# Altium schematic sheet PIC.SchDoc
size A4; SheetNumber: 1
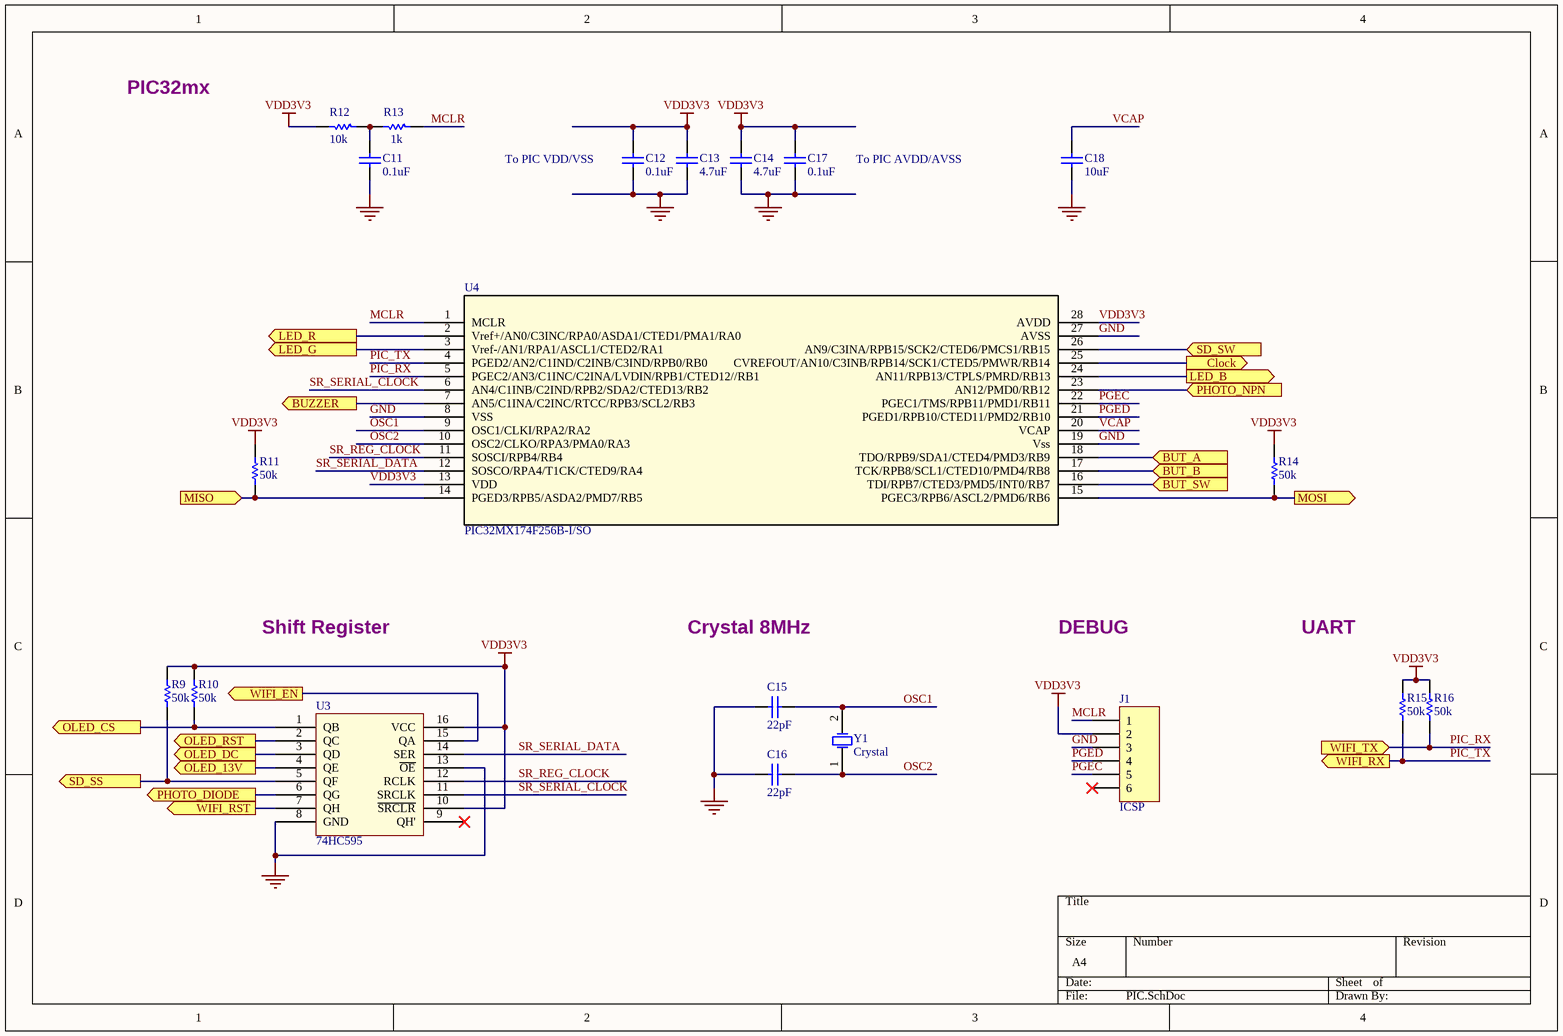
[diagram p0: PIC.SchDoc]

## Parts
C11  0.1uF  [CAPC1608X90N]
C12  0.1uF  [CAPC1608X90N]
C13  4.7uF  [CAPC1608X90N]
C14  4.7uF  [CAPC1608X90N]
C15  22pF  [CAPC1608X90N]
C16  22pF  [CAPC1608X90N]
C17  0.1uF  [CAPC1608X90N]
C18  10uF  [CAPC1608X90N]
J1  ICSP  [ICSP_HEADER]
R9  50k  [RESC1608X55N]
R10  50k  [RESC1608X55N]
R11  50k  [RESC1608X55N]
R12  10k  [RESC1608X55N]
R13  1k  [RESC1608X55N]
R14  50k  [RESC1608X55N]
R15  50k  [RESC1608X55N]
R16  50k  [RESC1608X55N]
U3  74HC595  [SOIC-16]
U4  PIC32MX174F256B-I/SO  [SOIC-28]
Y1  Crystal  [9C]

## Ports
BUT_A (in), BUT_B (in), BUT_SW (in), BUZZER (out), Clock (out), LED_B (out), LED_G (out), LED_R (out), MISO (in), MOSI (out), OLED_13V (out), OLED_CS (out), OLED_DC (out), OLED_RST (out), PHOTO_DIODE (out), PHOTO_NPN (in), SD_SS (out), SD_SW (in), WIFI_EN (out), WIFI_RST (out), WIFI_RX (out), WIFI_TX (in)

## Nets
GND: C11.1 C12.1 C13.1 C14.1 C15.2 C16.2 C17.1 C18.1 J1.3 U3.8(GND) U3.13(~{OE}) U4.8(VSS) U4.19(Vss) U4.27(AVSS)
VDD3V3: C12.2 C13.2 C14.2 C17.2 J1.2 R9.2 R10.2 R11.2 R12.2 R14.2 R15.2 R16.2 U3.10(~{SRCLR}) U3.16(VCC) U4.13(VDD) U4.28(AVDD)
BUT_A: U4.18(TDO/RPB9/SDA1/CTED4/PMD3/RB9) ; port BUT_A
BUT_B: U4.17(TCK/RPB8/SCL1/CTED10/PMD4/RB8) ; port BUT_B
BUT_SW: U4.16(TDI/RPB7/CTED3/PMD5/INT0/RB7) ; port BUT_SW
BUZZER: U4.7(AN5/C1INA/C2INC/RTCC/RPB3/SCL2/RB3) ; port BUZZER
Clock: U4.25(CVREFOUT/AN10/C3INB/RPB14/SCK1/CTED5/PMWR/RB14) ; port Clock
LED_B: U4.24(AN11/RPB13/CTPLS/PMRD/RB13) ; port LED_B
LED_G: U4.3(Vref-/AN1/RPA1/ASCL1/CTED2/RA1) ; port LED_G
LED_R: U4.2(Vref+/AN0/C3INC/RPA0/ASDA1/CTED1/PMA1/RA0) ; port LED_R
MCLR: J1.1 R13.1 U4.1(MCLR)
MISO: R11.1 U4.14(PGED3/RPB5/ASDA2/PMD7/RB5) ; port MISO
MOSI: R14.1 U4.15(PGEC3/RPB6/ASCL2/PMD6/RB6) ; port MOSI
OLED_13V: U3.4(QE) ; port OLED_13V
OLED_CS: R10.1 U3.1(QB) ; port OLED_CS
OLED_DC: U3.3(QD) ; port OLED_DC
OLED_RST: U3.2(QC) ; port OLED_RST
OSC1: C15.1 U4.9(OSC1/CLKI/RPA2/RA2) Y1.2
OSC2: C16.1 U4.10(OSC2/CLKO/RPA3/PMA0/RA3) Y1.1
PGEC: J1.5 U4.22(PGEC1/TMS/RPB11/PMD1/RB11)
PGED: J1.4 U4.21(PGED1/RPB10/CTED11/PMD2/RB10)
PHOTO_DIODE: U3.6(QG) ; port PHOTO_DIODE
PHOTO_NPN: U4.23(AN12/PMD0/RB12) ; port PHOTO_NPN
PIC_RX: R16.1 U4.5(PGEC2/AN3/C1INC/C2INA/LVDIN/RPB1/CTED12//RB1) ; port WIFI_TX
PIC_TX: R15.1 U4.4(PGED2/AN2/C1IND/C2INB/C3IND/RPB0/RB0) ; port WIFI_RX
SD_SS: R9.1 U3.5(QF) ; port SD_SS
SD_SW: U4.26(AN9/C3INA/RPB15/SCK2/CTED6/PMCS1/RB15) ; port SD_SW
SR_REG_CLOCK: U3.12(RCLK) U4.11(SOSCI/RPB4/RB4)
SR_SERIAL_CLOCK: U3.11(SRCLK) U4.6(AN4/C1INB/C2IND/RPB2/SDA2/CTED13/RB2)
SR_SERIAL_DATA: U3.14(SER) U4.12(SOSCO/RPA4/T1CK/CTED9/RA4)
VCAP: C18.2 U4.20(VCAP)
WIFI_EN: U3.15(QA) ; port WIFI_EN
WIFI_RST: U3.7(QH) ; port WIFI_RST
NetC11_2: C11.2 R12.1 R13.2

Not connected (* = marked no-connect by the designer): J1 6*; U3 9(QH')*

## Notes on the sheet
- PIC32mx
- (near C12) To PIC VDD/VSS
- To PIC AVDD/AVSS
- Shift Register
- Crystal 8MHz
- DEBUG
- UART

## Library data of the parts
C11-C14 C17 = Capacitor: Ceramic; Fabricant: MURATA; Fournisseur: Farnell
C15 C16 C18 = Capacitor: Fabricant: MURATA; Fournisseur: Farnell
J1 = Header 6: Header, 6-Pin; Fabricant: MOLEX; Fournisseur: Farnell; Fournisseur_REF: 9733078; Fabricant_REF: 53047-0610; Price: 0.403
R9 R10 = Resistor: Value: 1K; Published: 8-Jun-2000; LatestRevisionDate: 17-Jul-2002; LatestRevisionNote: Re-released for DXP Platform.; PackageReference: AXIAL-0.3; Publisher: Altium Limited; PackageDescription: Axial Device, Thru-Hole; 2 Leads; 0.3 in Pin Spacing
R11-R16 = Resistor: Fabricant: MULTICOMP; Fournisseur: Farnell
U3 = 74HC595: Shift Register
U4 = PIC32MX174F256B-I/SO: PIC32; Fabricant: MICROCHIP; Fournisseur: Farnell; Fournisseur_REF: 2775021; Price: 3,84; Fabricant_REF: PIC32MX174F256B-I/SO
Y1 = Crystal: Crystal Oscillator; Fabricant: TXC; Fournisseur: Farnell; Fournisseur_REF: 1842347; Fabricant_REF: 9C-8.000MEEJ-T; Price: 0.604